# EAGLE schematic esp-mqtt-doorbell-receiver (EAGLE 7.7.0)
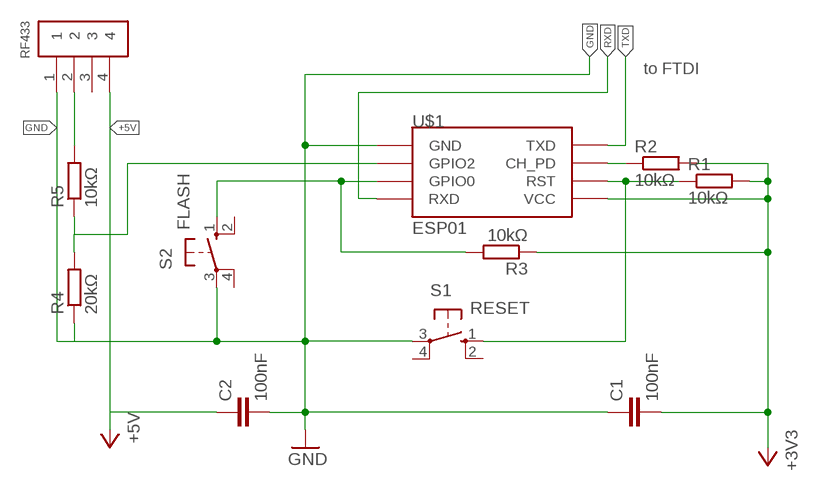
[diagram p0: schematic, sheet 1]

## Parts
C1  100nF  C-EU025-025X050  [C025-025X050]
C2  100nF  C-EU025-025X050  [C025-025X050]
R1  10kΩ  R-EU_0204/7  [0204/7]
R2  10kΩ  R-EU_0204/7  [0204/7]
R3  10kΩ  R-EU_0204/7  [0204/7]
R4  20kΩ  R-EU_0204/7  [0204/7]
R5  10kΩ  R-EU_0204/7  [0204/7]
RF433  1X4-BIG  [1X04-BIG]
S1  RESET  10-XX  [B3F-10XX]
S2  FLASH  10-XX  [B3F-10XX]
U$1  ESP01  [ESP01]

## Nets
+3V3: C1.2 R1.2 R2.2 R3.1 U$1.VCC
+5V: C2.1 RF433.4
GND: C1.1 C2.2 R4.1 RF433.1 S1.3(P) S2.3(P) U$1.GND
N$1: R1.1 S1.1(S) U$1.RST
N$2: R3.2 S2.1(S) U$1.GPIO0
N$3: R2.1 U$1.CH_PD
N$4: R5.2 RF433.2
N$5: R4.2 R5.1 U$1.GPIO2
RXD: U$1.RX(RXD)
TXD: U$1.TX(TXD)
Unconnected: RF433.3 S1.2(S1) S1.4(P1) S2.2(S1) S2.4(P1)

## Notes on the sheet
- to FTDI

## Library data of the parts
C1 C2 = rcl:C-EU: CAPACITOR, European symbol
R1-R5 = rcl:R-EU_: RESISTOR, European symbol
RF433 = adafruit:1X4: 4-pin connector
S1 S2 = switch-omron:10-XX: OMRON SWITCH; MPN: B3F-1000; OC_FARNELL: 176432; OC_NEWARK: 36M3542
U$1 = esp8266modules:ESP01: ESP8266 Wifi module 01